# Altium schematic sheet 04_ZYNQ_MISC_INTERFACE.SchDoc
size 420 x 297 mm; SheetNumber: 4; SheetTotal: 7
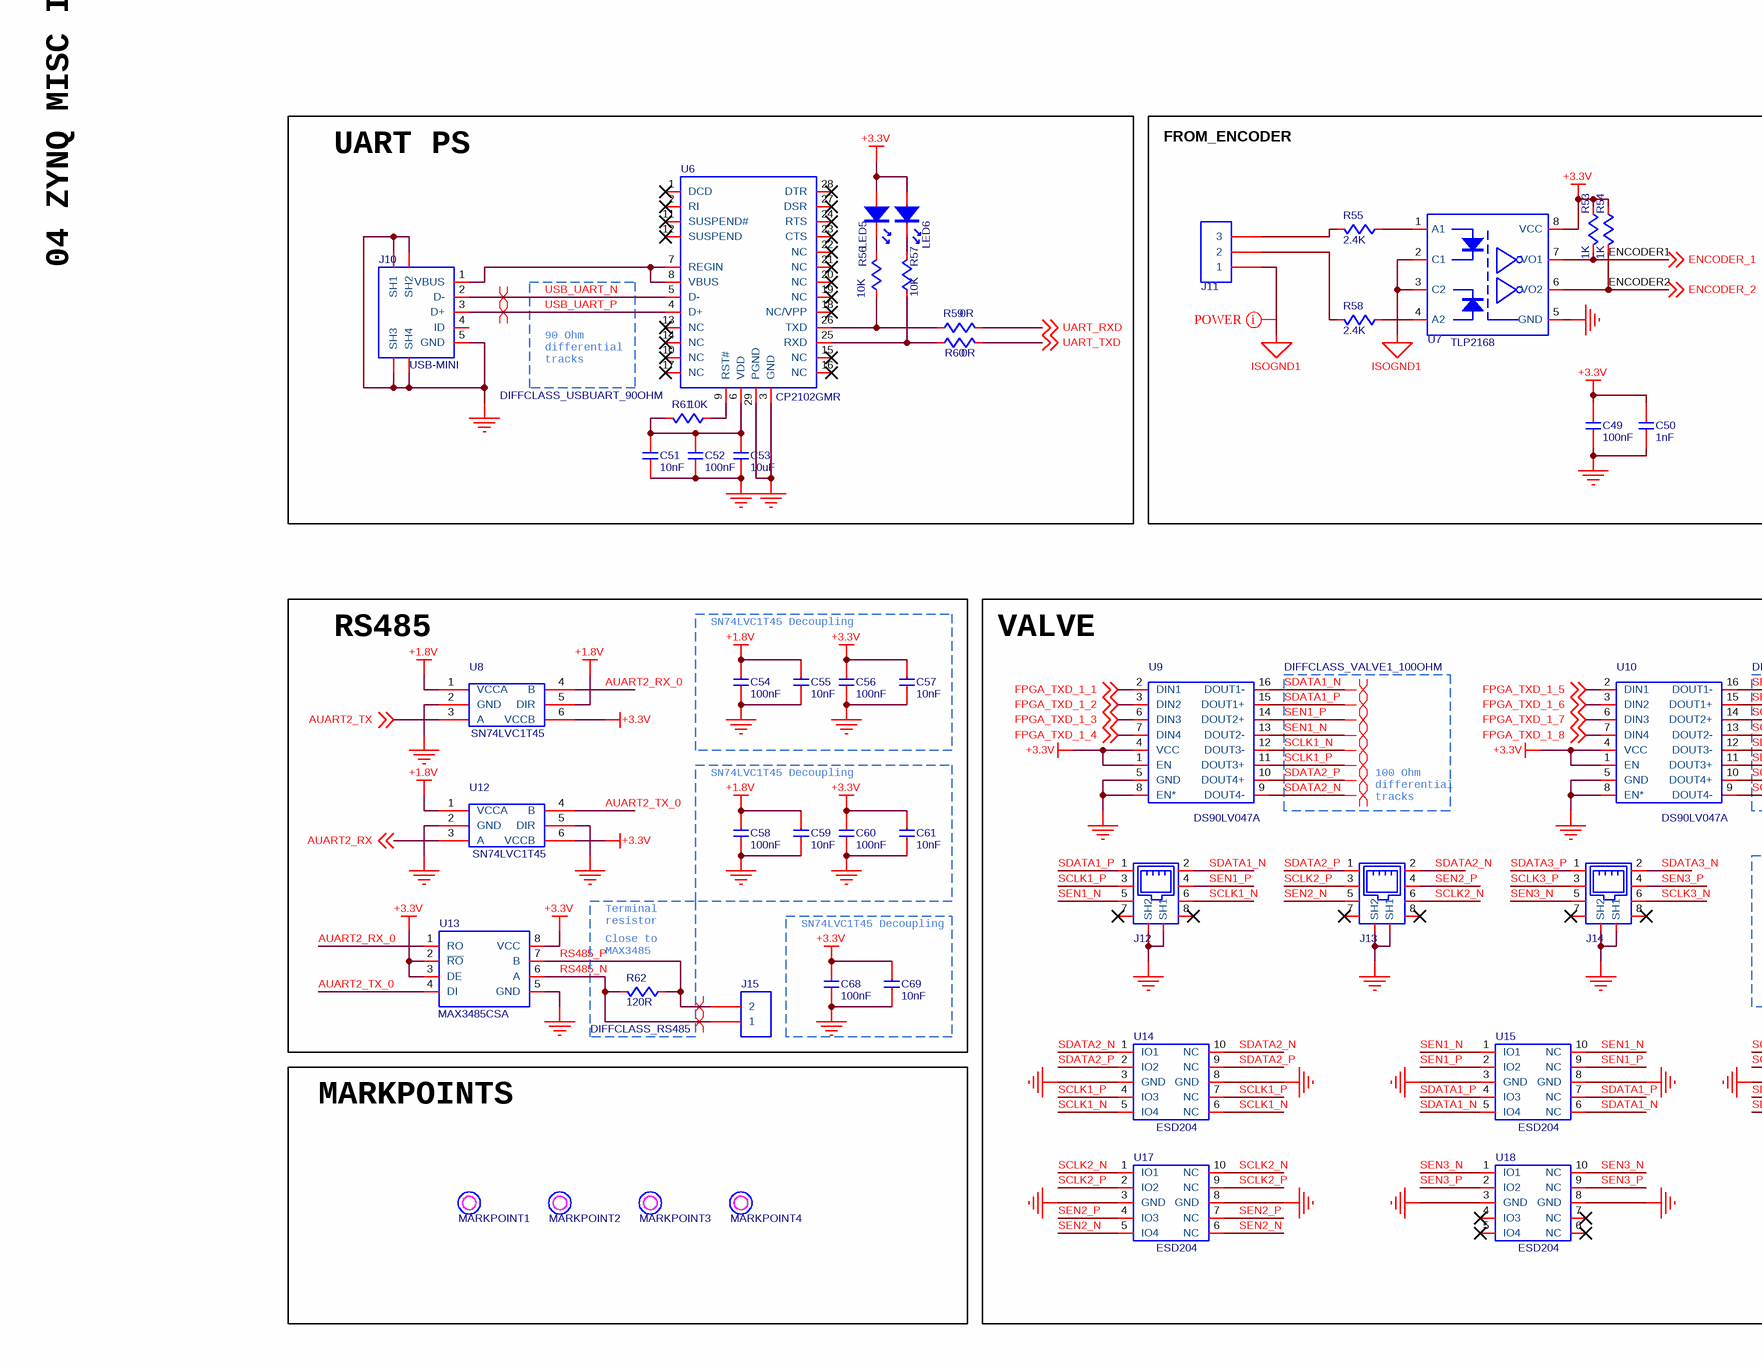
[diagram p0: 04_ZYNQ_MISC_INTERFACE.SchDoc, left]
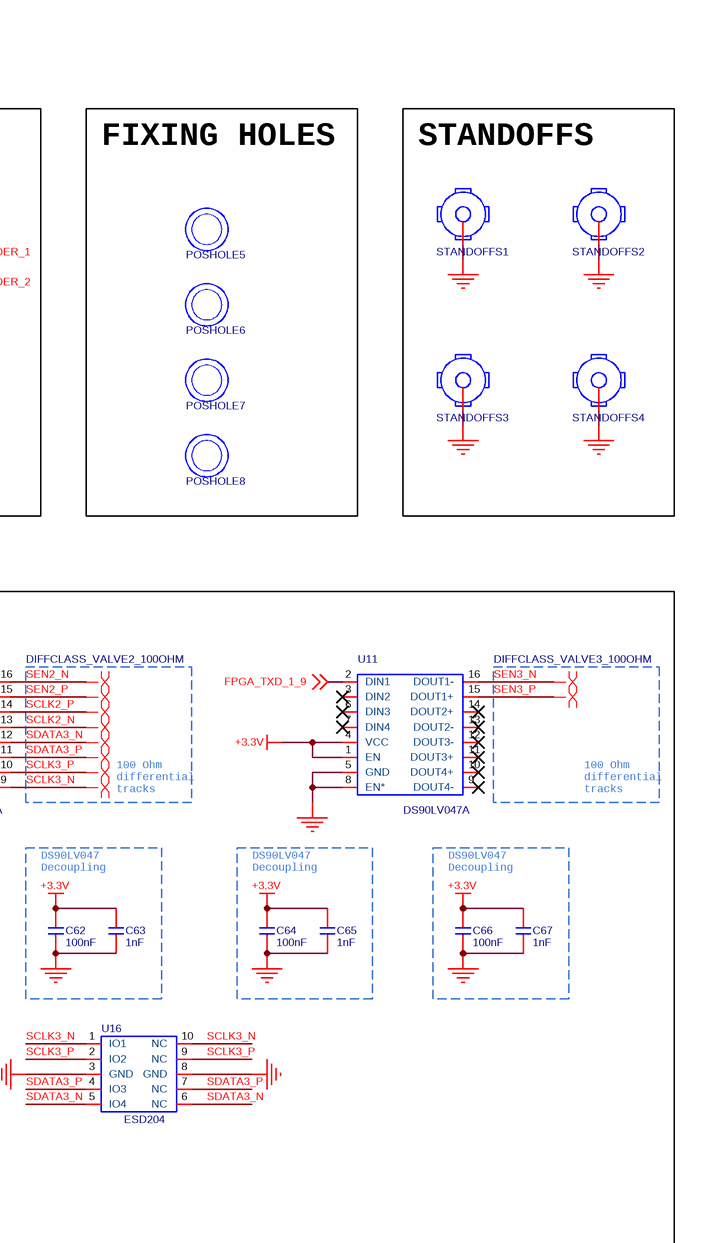
[diagram p1: 04_ZYNQ_MISC_INTERFACE.SchDoc, right]

## Parts
C49  value 100nF  [C0402]  (hidden comment: C-NOMO)
C50  value 1nF  [C0402]  (hidden comment: C-NOMO)
C51  value 10nF  [C0402]  (hidden comment: C-NOMO)
C52  value 100nF  [C0402]  (hidden comment: C-NOMO)
C53  value 10uF  [C0805]  (hidden comment: C-NOMO)
C54  value 100nF  [C0402]  (hidden comment: C-NOMO)
C55  value 10nF  [C0402]  (hidden comment: C-NOMO)
C56  value 100nF  [C0402]  (hidden comment: C-NOMO)
C57  value 10nF  [C0402]  (hidden comment: C-NOMO)
C58  value 100nF  [C0402]  (hidden comment: C-NOMO)
C59  value 10nF  [C0402]  (hidden comment: C-NOMO)
C60  value 100nF  [C0402]  (hidden comment: C-NOMO)
C61  value 10nF  [C0402]  (hidden comment: C-NOMO)
C62  value 100nF  [C0402]  (hidden comment: C-NOMO)
C63  value 1nF  [C0402]  (hidden comment: C-NOMO)
C64  value 100nF  [C0402]  (hidden comment: C-NOMO)
C65  value 1nF  [C0402]  (hidden comment: C-NOMO)
C66  value 100nF  [C0402]  (hidden comment: C-NOMO)
C67  value 1nF  [C0402]  (hidden comment: C-NOMO)
C68  value 100nF  [C0402]  (hidden comment: C-NOMO)
C69  value 10nF  [C0402]  (hidden comment: C-NOMO)
J10  USB-MINI  [USB-MINI]
J11  HDR1X3  [KF301-5.0-3P]  (value not drawn)
J12  RJ45-UP  [RJ45-UP]  (value not drawn)
J13  RJ45-UP  [RJ45-UP]  (value not drawn)
J14  RJ45-UP  [RJ45-UP]  (value not drawn)
J15  HDR1X2  [KF301-5.0-2P]  (value not drawn)
LED5  LED  [LED0603]  (value not drawn)
LED6  LED  [LED0603]  (value not drawn)
MARKPOINT1  MARKPOINT  [MARKPOINT-1.0]  (value not drawn)
MARKPOINT2  MARKPOINT  [MARKPOINT-1.0]  (value not drawn)
MARKPOINT3  MARKPOINT  [MARKPOINT-1.0]  (value not drawn)
MARKPOINT4  MARKPOINT  [MARKPOINT-1.0]  (value not drawn)
POSHOLE5  POSHOLE  [POSHOLE-3.2]  (value not drawn)
POSHOLE6  POSHOLE  [POSHOLE-3.2]  (value not drawn)
POSHOLE7  POSHOLE  [POSHOLE-3.2]  (value not drawn)
POSHOLE8  POSHOLE  [POSHOLE-3.2]  (value not drawn)
R53  value 1K  [R0402]  (hidden comment: R)
R54  value 1K  [R0402]  (hidden comment: R)
R55  value 2.4K  [R2512]  (hidden comment: R)
R56  value 10K  [R0402]  (hidden comment: R)
R57  value 10K  [R0402]  (hidden comment: R)
R58  value 2.4K  [R2512]  (hidden comment: R)
R59  value 0R  [R0402]  (hidden comment: R)
R60  value 0R  [R0402]  (hidden comment: R)
R61  value 10K  [R0402]  (hidden comment: R)
R62  value 120R  [R0402]  (hidden comment: R)
STANDOFFS1  STANDOFFS  [STANDOFFS-5-2.5]  (value not drawn)
STANDOFFS2  STANDOFFS  [STANDOFFS-5-2.5]  (value not drawn)
STANDOFFS3  STANDOFFS  [STANDOFFS-5-2.5]  (value not drawn)
STANDOFFS4  STANDOFFS  [STANDOFFS-5-2.5]  (value not drawn)
U6  CP2102GMR  [CP2102GMR]
U7  TLP2168  [TLP2168]
U8  SN74LVC1T45  [SN74LVC1T45]
U9  DS90LV047A  [DS90LV047]
U10  DS90LV047A  [DS90LV047]
U11  DS90LV047A  [DS90LV047]
U12  SN74LVC1T45  [SN74LVC1T45]
U13  MAX3485CSA  [MAX3485CSA]
U14  ESD204  [ESD204]
U15  ESD204  [ESD204]
U16  ESD204  [ESD204]
U17  ESD204  [ESD204]
U18  ESD204  [ESD204]

## Blocks framed on the sheet
UART PS: C51-C53 J10 LED5 LED6 R56 R57 R59-R61 U6
FROM_ENCODER: C49 C50 J11 R53-R55 R58 U7
FIXING HOLES: POSHOLE5-POSHOLE8
STANDOFFS: STANDOFFS1-STANDOFFS4
RS485: C54-C61 C68 C69 J15 R62 U8 U12 U13
VALVE: C62-C67 J12-J14 U9-U11 U14-U18
MARKPOINTS: MARKPOINT1-MARKPOINT4

## Nets
+1.8V: C54.1 C55.2 C58.1 C59.2 U8.1(VCCA) U8.5(DIR) U12.1(VCCA)
+3.3V: C49.2 C50.2 C56.1 C57.2 C60.1 C61.2 C62.1 C63.2 C64.1 C65.2 C66.1 C67.2 C68.1 C69.2 LED5.2 LED6.2 R53.2 R54.2 U7.8(VCC) U8.6(VCCB) U9.1(EN) U9.4(VCC) U10.1(EN) U10.4(VCC) U11.1(EN) U11.4(VCC) U12.6(VCCB) U13.2(~{RO}) U13.3(DE) U13.8(VCC)
GND: C49.1 C50.1 C51.1 C52.1 C53.2 C54.2 C55.1 C56.2 C57.1 C58.2 C59.1 C60.2 C61.1 C62.2 C63.1 C64.2 C65.1 C66.2 C67.1 C68.2 C69.1 J10.5(GND) J10.SH1 J10.SH2 J10.SH3 J10.SH4 J12.SH1 J12.SH2 J13.SH1 J13.SH2 J14.SH1 J14.SH2 STANDOFFS1.0 STANDOFFS2.0 STANDOFFS3.0 STANDOFFS4.0 U6.3(GND) U6.29(PGND) U7.5(GND) U8.2(GND) U9.5(GND) U9.8(EN*) U10.5(GND) U10.8(EN*) U11.5(GND) U11.8(EN*) U12.2(GND) U12.5(DIR) U13.5(GND) U14.3(GND) U14.8(GND) U15.3(GND) U15.8(GND) U16.3(GND) U16.8(GND) U17.3(GND) U17.8(GND) U18.3(GND) U18.8(GND)
ISOGND1: J11.1 U7.2(C1) U7.3(C2)
AUART2_RX: U12.3(A) ; off-sheet AUART2_RX
AUART2_RX_0: U8.4(B) U13.1(RO)
AUART2_TX: U8.3(A) ; off-sheet AUART2_TX
AUART2_TX_0: U12.4(B) U13.4(DI)
ENCODER_1: R53.1 U7.7(VO1) ; off-sheet ENCODER_1
ENCODER_2: R54.1 U7.6(VO2) ; off-sheet ENCODER_2
FPGA_TXD_1_1: U9.2(DIN1) ; off-sheet FPGA_TXD_1_1
FPGA_TXD_1_2: U9.3(DIN2) ; off-sheet FPGA_TXD_1_2
FPGA_TXD_1_3: U9.6(DIN3) ; off-sheet FPGA_TXD_1_3
FPGA_TXD_1_4: U9.7(DIN4) ; off-sheet FPGA_TXD_1_4
FPGA_TXD_1_5: U10.2(DIN1) ; off-sheet FPGA_TXD_1_5
FPGA_TXD_1_6: U10.3(DIN2) ; off-sheet FPGA_TXD_1_6
FPGA_TXD_1_7: U10.6(DIN3) ; off-sheet FPGA_TXD_1_7
FPGA_TXD_1_8: U10.7(DIN4) ; off-sheet FPGA_TXD_1_8
FPGA_TXD_1_9: U11.2(DIN1) ; off-sheet FPGA_TXD_1_9
RS485_N: J15.1 R62.1 U13.6(A)
RS485_P: J15.2 R62.2 U13.7(B)
SCLK1_N: J12.6 U9.12(DOUT3-) U14.5(IO4) U14.6(NC)
SCLK1_P: J12.3 U9.11(DOUT3+) U14.4(IO3) U14.7(NC)
SCLK2_N: J13.6 U10.13(DOUT2-) U17.1(IO1) U17.10(NC)
SCLK2_P: J13.3 U10.14(DOUT2+) U17.2(IO2) U17.9(NC)
SCLK3_N: J14.6 U10.9(DOUT4-) U16.1(IO1) U16.10(NC)
SCLK3_P: J14.3 U10.10(DOUT4+) U16.2(IO2) U16.9(NC)
SDATA1_N: J12.2 U9.16(DOUT1-) U15.5(IO4) U15.6(NC)
SDATA1_P: J12.1 U9.15(DOUT1+) U15.4(IO3) U15.7(NC)
SDATA2_N: J13.2 U9.9(DOUT4-) U14.1(IO1) U14.10(NC)
SDATA2_P: J13.1 U9.10(DOUT4+) U14.2(IO2) U14.9(NC)
SDATA3_N: J14.2 U10.12(DOUT3-) U16.5(IO4) U16.6(NC)
SDATA3_P: J14.1 U10.11(DOUT3+) U16.4(IO3) U16.7(NC)
SEN1_N: J12.5 U9.13(DOUT2-) U15.1(IO1) U15.10(NC)
SEN1_P: J12.4 U9.14(DOUT2+) U15.2(IO2) U15.9(NC)
SEN2_N: J13.5 U10.16(DOUT1-) U17.5(IO4) U17.6(NC)
SEN2_P: J13.4 U10.15(DOUT1+) U17.4(IO3) U17.7(NC)
SEN3_N: J14.5 U11.16(DOUT1-) U18.1(IO1) U18.10(NC)
SEN3_P: J14.4 U11.15(DOUT1+) U18.2(IO2) U18.9(NC)
UART_RXD: R59.1 ; off-sheet UART_RXD
UART_TXD: R60.1 ; off-sheet UART_TXD
USB_UART_N: J10.2(D-) U6.5(D-)
USB_UART_P: J10.3(D+) U6.4(D+)
NetC51_2: C51.2 C52.2 C53.1 R61.1 U6.6(VDD)
NetJ10_1: J10.1(VBUS) U6.7(REGIN) U6.8(VBUS)
NetJ11_2: J11.2 R58.1
NetJ11_3: J11.3 R55.1
NetLED5_1: LED5.1 R56.1
NetLED6_1: LED6.1 R57.1
NetR55_2: R55.2 U7.1(A1)
NetR56_2: R56.2 R59.2 U6.26(TXD)
NetR57_2: R57.2 R60.2 U6.25(RXD)
NetR58_2: R58.2 U7.4(A2)
NetR61_2: R61.2 U6.9(RST#)

Not connected (* = marked no-connect by the designer): J10 4(ID); J12 7* 8*; J13 7* 8*; J14 7* 8*; U6 1(DCD)* 2(RI)* 10(NC)* 11(SUSPEND#)* 12(SUSPEND)* 13(NC)* 14(NC)* 15(NC)* 16(NC)* 17(NC)* 18(NC/VPP)* 19(NC)* 20(NC)* 21(NC)* 22(NC)* 23(CTS)* 24(RTS)* 27(DSR)* 28(DTR)*; U11 3(DIN2)* 6(DIN3)* 7(DIN4)* 9(DOUT4-)* 10(DOUT4+)* 11(DOUT3+)* 12(DOUT3-)* 13(DOUT2-)* 14(DOUT2+)*; U18 4(IO3)* 5(IO4)* 6(NC)* 7(NC)*

## Layout directives
differential pair; differential pair class DIFFCLASS_RS485: RS485_N, RS485_P
differential pair; differential pair class DIFFCLASS_USBUART_90OHM: USB_UART_N, USB_UART_P
differential pair; differential pair class DIFFCLASS_VALVE1_100OHM: SCLK1_N, SCLK1_P, SDATA1_N, SDATA1_P, SEN1_N, SEN1_P
differential pair; differential pair class DIFFCLASS_VALVE2_100OHM: SCLK2_N, SCLK2_P, SDATA2_N, SDATA2_P, SEN2_N, SEN2_P
differential pair; differential pair class DIFFCLASS_VALVE3_100OHM: SCLK3_N, SCLK3_P, SDATA3_N, SDATA3_P, SEN3_N, SEN3_P
net class POWER: ISOGND1

## Notes on the sheet
- (near R54) ENCODER1
- 04 ZYNQ MISC INTEFACE
- ENCODER2
- 90 Ohm differential tracks
- SN74LVC1T45 Decoupling
- 100 Ohm differential tracks
- Terminal resistor
- DS90LV047 Decoupling
- (near R62) Close to MAX3485

## Library data of the parts
C49-C69 = C-NOMO: voltage: 25V; precision: 5%
R53-R62 = R: precision: 1%
J11 = HDR1X3: Supplier 1: LCSC; Supplier Part Number 1: C474884; Supplier 2: LCSC; Supplier Part Number 2: C609572
J12-J14 = RJ45-UP: Supplier 1: LCSC; Supplier Part Number 1: C2683357
U14-U18 = ESD204: Supplier 1: LCSC; Supplier Part Number 1: C553132